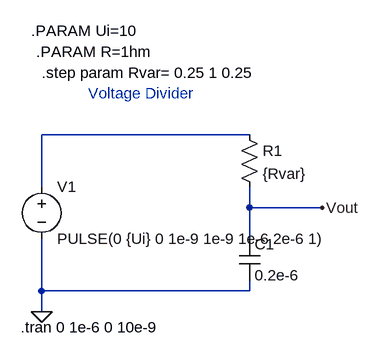
[diagram p0: schematic 1stOrderLP.asc]
1stOrderLP.asc, the LTspice schematic file:
Version 4
SHEET 1 880 680
WIRE 272 112 -48 112
WIRE -48 192 -48 112
WIRE 272 224 272 192
WIRE 384 224 272 224
WIRE 272 272 272 224
WIRE -48 352 -48 272
WIRE 272 352 272 336
WIRE 272 352 -48 352
WIRE -48 384 -48 352
FLAG -48 384 0
FLAG 384 224 Vout
SYMBOL res 256 96 R0
SYMATTR InstName R1
SYMATTR Value {Rvar}
SYMBOL voltage -48 176 R0
WINDOW 123 0 0 Left 0
WINDOW 39 0 0 Left 0
SYMATTR InstName V1
SYMATTR Value PULSE(0 {Ui} 0 1e-9 1e-9 1e-6 2e-6 1)
SYMBOL cap 256 272 R0
SYMATTR InstName C1
SYMATTR Value 0.2e-6
TEXT -80 408 Left 2 !.tran 0 1e-6 0 10e-9
TEXT 24 48 Left 2 ;Voltage Divider
TEXT -64 -48 Left 2 !.PARAM Ui=10
TEXT -56 -16 Left 2 !.PARAM R=1hm
TEXT -48 16 Left 2 !.step param Rvar= 0.25 1 0.25

The netlist it stands for:
* 1stOrderLP.asc
R1 N001 Vout {Rvar}
V1 N001 0 PULSE(0 {Ui} 0 1e-9 1e-9 1e-6 2e-6 1)
C1 Vout 0 0.2e-6
.tran 0 1e-6 0 10e-9
* Voltage Divider
.PARAM Ui=10
.PARAM R=1hm
.step param Rvar= 0.25 1 0.25
.backanno
.end

* Results of the author's LTspice run, read from the files saved beside the schematic
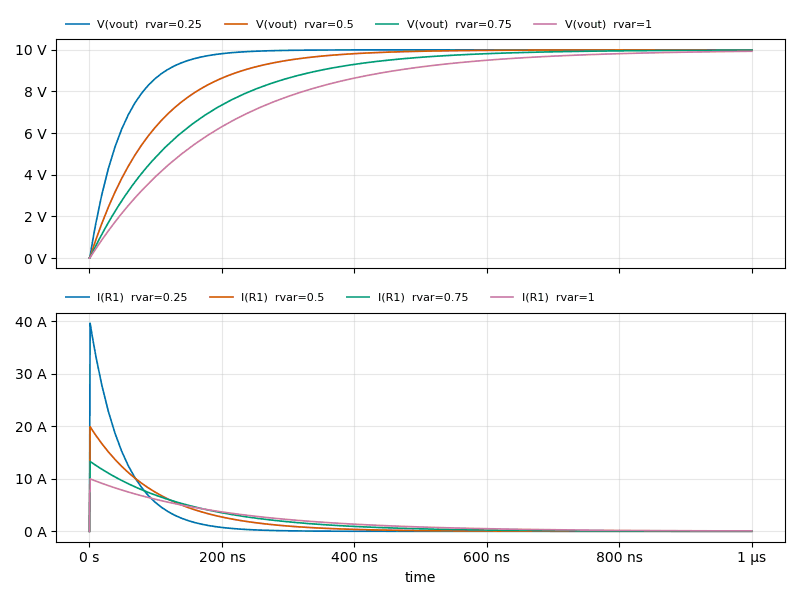
[diagram p1: Transient Analysis of 1stOrderLP.asc, plotted from the saved traces]
* Transient Analysis, 4 runs:
*   V(vout) [rvar=0.25]: min 0 V, max 10 V, average 9.495 V, rms 9.616 V, last 10 V
*   V(vout) [rvar=0.5]: min 0 V, max 10 V, average 8.995 V, rms 9.217 V, last 10 V
*   V(vout) [rvar=0.75]: min 0 V, max 9.987 V, average 8.496 V, rms 8.803 V, last 9.987 V
*   V(vout) [rvar=1]: min 0 V, max 9.933 V, average 8.008 V, rms 8.38 V, last 9.933 V
*   I(R1) [rvar=0.25]: min 0 A, max 39.6 A, average 2 A, rms 6.327 A, last 0 A
*   I(R1) [rvar=0.5]: min 0 A, max 19.9 A, average 2 A, rms 4.47 A, last 905.1 µA
*   I(R1) [rvar=0.75]: min 0 A, max 13.29 A, average 1.999 A, rms 3.652 A, last 16.98 mA
*   I(R1) [rvar=1]: min 0 A, max 9.975 A, average 1.987 A, rms 3.162 A, last 67.48 mA